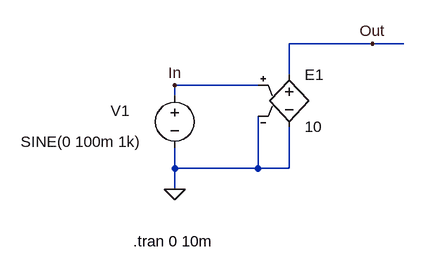
[diagram p0: schematic Draft2.asc]
Draft2.asc, the LTspice schematic file:
Version 4.1
SHEET 1 880 680
WIRE 352 80 224 80
WIRE 400 80 352 80
WIRE 224 128 224 80
WIRE 176 144 48 144
WIRE 48 160 48 144
WIRE 48 272 48 240
WIRE 176 272 176 192
WIRE 176 272 48 272
WIRE 224 272 224 208
WIRE 224 272 176 272
WIRE 48 304 48 272
FLAG 48 304 0
FLAG 352 80 Out
FLAG 48 144 In
SYMBOL e 224 112 R0
SYMATTR InstName E1
SYMATTR Value 10
SYMBOL voltage 48 144 R0
WINDOW 0 -99 39 Left 2
WINDOW 3 -237 87 Left 2
WINDOW 123 0 0 Left 0
WINDOW 39 0 0 Left 0
SYMATTR InstName V1
SYMATTR Value SINE(0 100m 1k)
TEXT -16 384 Left 2 !.tran 0 10m

The netlist it stands for:
* Draft2.asc
E1 Out 0 In 0 10
V1 In 0 SINE(0 100m 1k)
.tran 0 10m
.backanno
.end